# EAGLE design lighting (EAGLE 9.4.0)
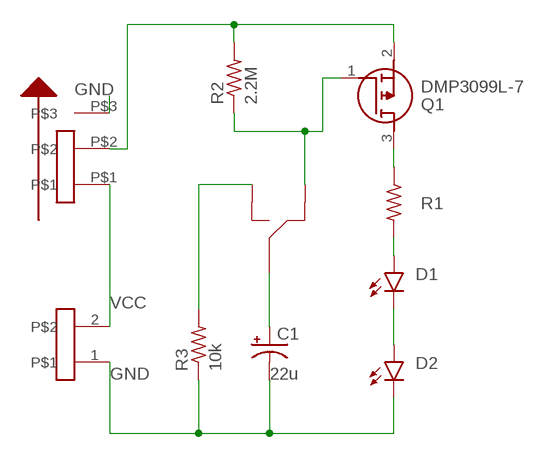
[diagram p0: schematic, sheet 1]

## Parts
C1  WE-CAP  [WE-CAP]
D1  LUXEON2835C  [LUXEON2835C]
D2  LUXEON2835C  [LUXEON2835C]
J1  22-05-3021  [7395-02]
Q1  DMP3099L-7  [SOT96P240X120-3N]
R1  R-US_R1210  [R1210]
R2  2.2M  R-US_R1206  [R1206]
R3  10k  R-US_R1206  [R1206]
S2  CL-SB-12B-01T  [CL-SB-12B-01T]
U$1  KSK-1C90U  [KSK-1C90U]

## Nets
COM: C1.+ U$1.COM
GND: C1.- D2.-(C) J1.1 R3.1 S2.P$3
N$1: D1.-(C) D2.+(A)
N$2: D1.+(A) R1.2
N$3: Q1.3(D) R1.1
NC: Q1.1(G) R2.1 U$1.NC
NO: R3.2 U$1.NO
PWR: Q1.2(S) R2.2 S2.P$2
VCC: J1.2 S2.P$1

## Library data of the parts
C1 = my_lib:WE-CAP; C: 22u
D1 D2 = my_lib:LUXEON2835C
J1 = my_lib:22-05-3021
Q1 = SamacSys_Parts:DMP3099L-7: Diodes Inc DMP3099L-7 P-channel MOSFET Transistor, 2.9 A, -30 V, 3-Pin SOT-23 Source: Datasheet <https://componentsearchengine.com/Datasheets/1/DMP3099L-7.pdf>; DESCRIPTION: Diodes Inc DMP3099L-7 P-channel MOSFET Transistor, 2.9 A, -30 V, 3-Pin SOT-23; HEIGHT: 1.2mm; MANUFACTURER_NAME: Diodes Inc.; MANUFACTURER_PART_NUMBER: DMP3099L-7; MOUSER_PART_NUMBER: 621-DMP3099L-7; MOUSER_PRICE-STOCK: https://www.mouser.com/Search/Refine.aspx?Keyword=621-DMP3099L-7
R1-R3 = rcl:R-US_: RESISTOR, American symbol; SPICEPREFIX: R
S2 = my_lib:CL-SB-12B-01T
U$1 = my_lib:KSK-1C90U

## Board
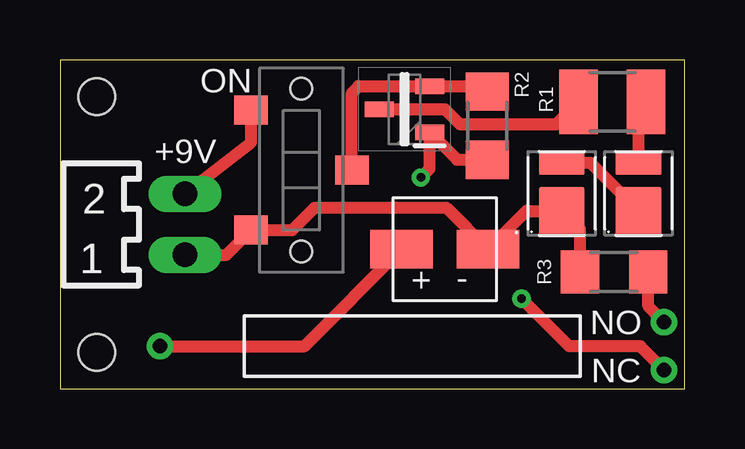
[diagram p1: board, top side]
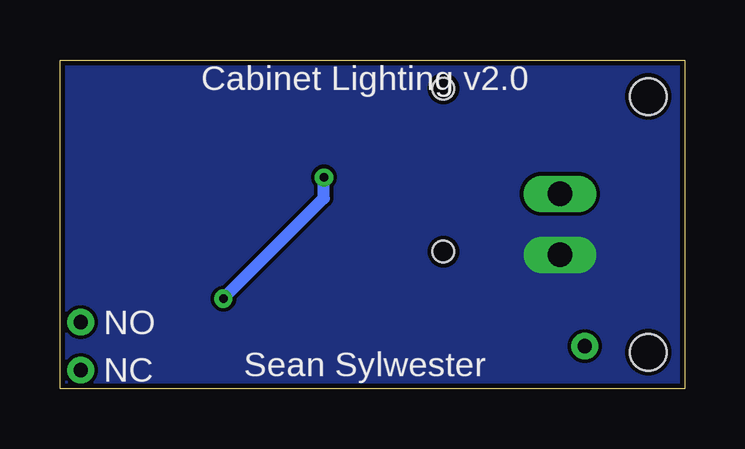
[diagram p2: board, bottom side, seen from below]

Size 26.04 x 13.72 mm. Coordinates in mm from the lower left corner, seen from the top.
Outline: 0,0 26.04,0 26.04,13.72 0,13.72 0,0
Copper layers (1*16): Top 0.035mm / dielectric 1.5mm / Bottom 0.035mm
Design rules "default *": minimum track width 6mil, minimum drill 0.35mm, track to track 6mil, track to pad 6mil, pad to pad 6mil, via to via 6mil, smd to smd 6mil, copper to edge 8mil, drill to drill 6mil, minimum pad ring 10mil, minimum via ring 8mil, stop-mask expansion 4mil, vias tented up to drill 0mil, thermal gap 10mil
Holes 1.52 mm at 1.52,12.19 1.52,1.52

### Footprints (pad centres in the part's own frame; a part is rotated, then mirrored left to right if it is on the bottom)
WE-CAP = smd 2.6 x 1.6: + 1.8,0; - -1.8,0
LUXEON2835C = smd 0.97 x 1.9: + 1.265,0 | smd 2.03 x 1.9: - -0.735,0
7395-02 = drill 1.016 long: 1 1.27,0; 2 -1.27,0
SOT96P240X120-3N = smd 1.2 x 0.65: 1 -1.05,0.96; 2 -1.05,-0.96; 3 1.05,0
R1210 = smd 1.6 x 2.7: 1 -1.4,0; 2 1.4,0
R1206 = smd 1.6 x 1.803: 1 -1.422,0; 2 1.422,0
CL-SB-12B-01T = smd 1.2 x 1.4: P$1 -2.5,-2.1; P$2 0,2.1; P$3 2.5,-2.1 | hole 0.9: -3.4,0; 3.4,0
KSK-1C90U = drill 0.6: COM -3.5,1.27; NC 17.5,0.27; NO 17.5,2.27

### Placement (x,y rotation side)
C1  16.03,5.82 180 top
D1  24.1,8.15 90 top
D2  20.9,8.15 90 top
J1  5.21,6.86 270 top
Q1  14.35,11.66 180 top
R1  23.01,11.96 0 top
R2  17.81,10.97 90 top
R3  23.09,4.88 0 top
S2  10.06,9.12 270 top
U$1  7.67,0.51 0 top

### Tracks (layer width: path | path; a pad name or v marks a point on that pad's centre or on a via)
COM
  Top 0.508: U$1.COM 10.19,1.78 C1.+
GND
  Top 0.508: R3.1 21.67,6.66 D2.- 19.43,7.42 C1.- 16.09,7.56 10.61,7.56 9.68,6.62 S2.P$3 6.93,5.59 J1.1
  pour Bottom (no thermals): 0,13.72 26.04,13.72 26.04,0 0,0
N$1
  Top 0.508: D1.- 22.11,9.42 D2.+
N$2
  Top 0.508: D1.+ 24.11,11.66 R1.2
N$3
  Top 0.508: Q1.3 16.04,11.66 16.66,11.04 20.68,11.04 R1.1
NC  (via drill 0.35)
  Top 0.508: R2.1 16.55,9.55 Q1.1 15.4,9.18 v15.04,8.81 | U$1.NC 24.18,1.77 21.22,1.77 v19.23,3.76
  Bottom 0.508: v19.23,3.76 15.04,7.95 v15.04,8.81
NO
  Top 0.508: U$1.NO 24.51,3.44 R3.2
PWR
  Top 0.508: S2.P$2 12.16,12.34 12.45,12.62 Q1.2 17.58,12.62 R2.2
VCC
  Top 0.508: J1.2 7.96,10.27 S2.P$1

### Text on the board
tPlace: ON | +9V | + | - | NO | NC
bPlace: Cabinet Lighting v2.0 | NO | Sean Sylwester | NC